# EAGLE schematic LightPCB (EAGLE 7.3.0)
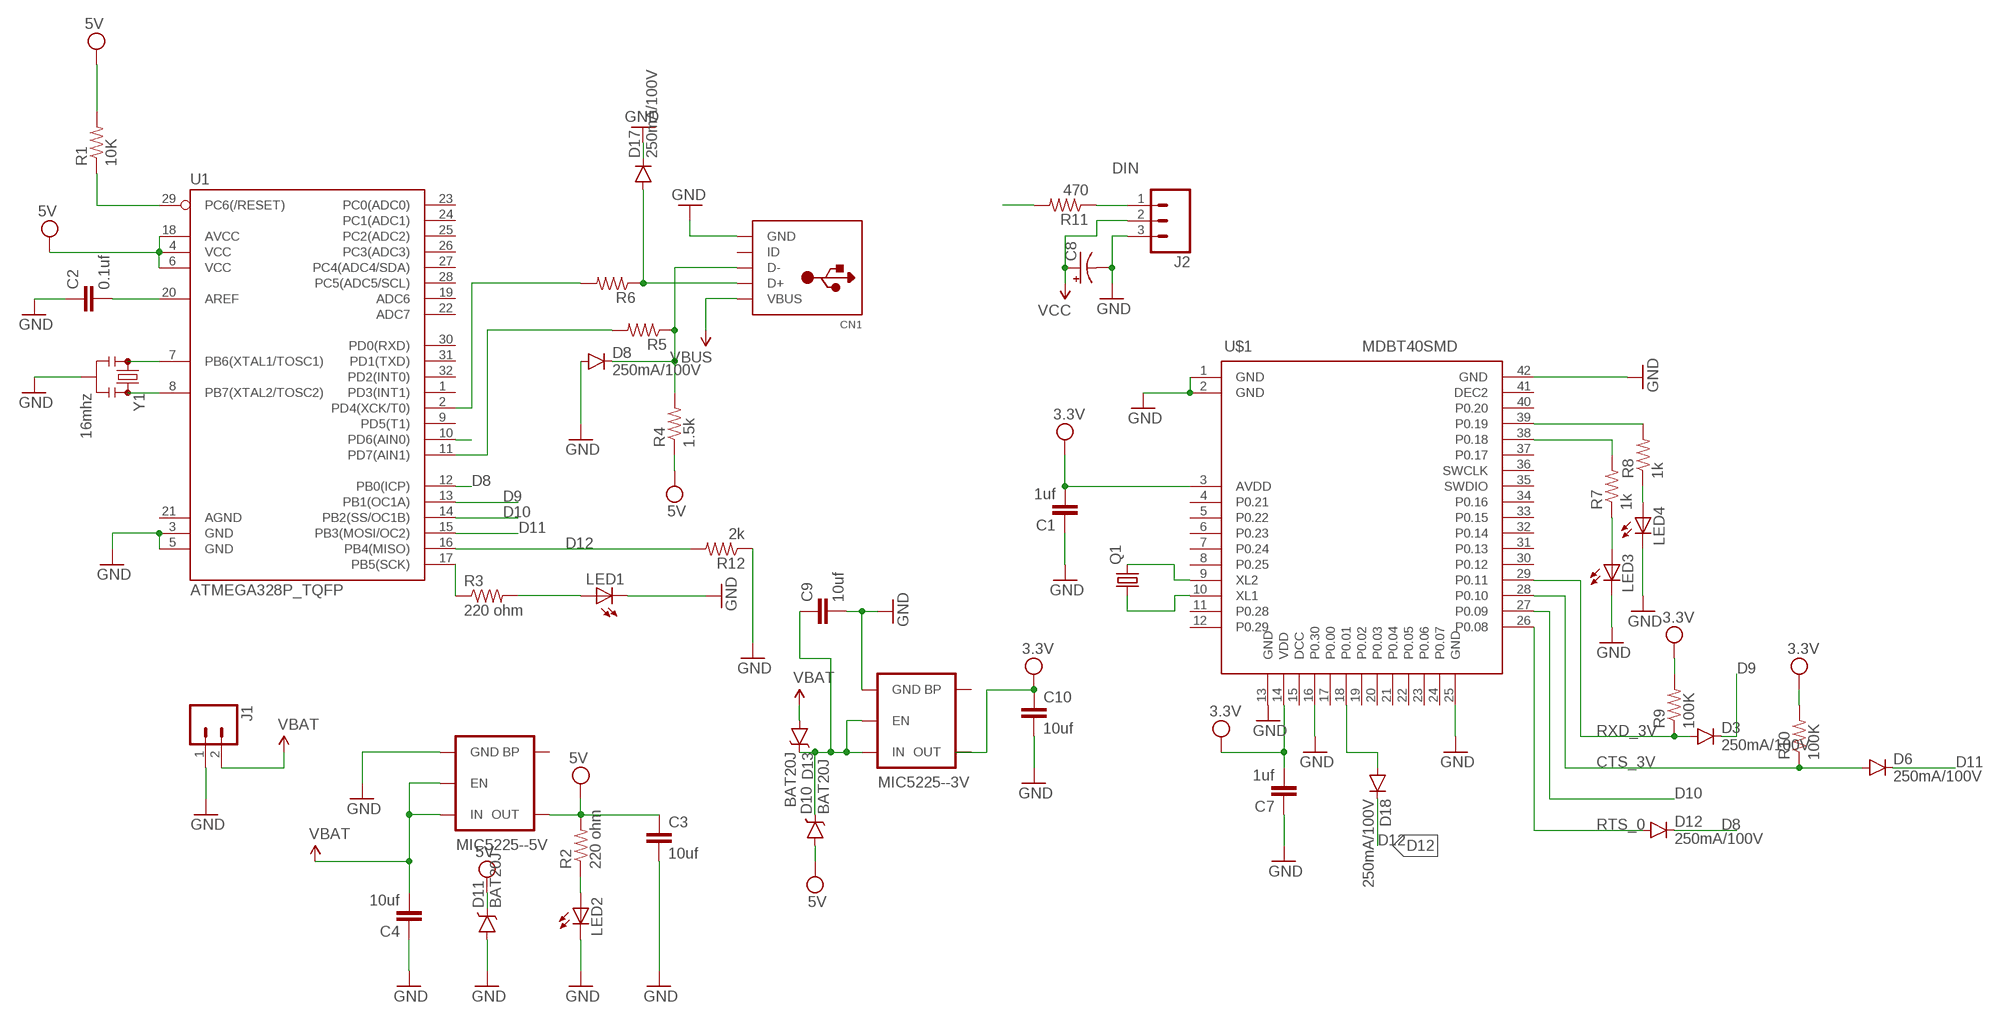
[diagram p0: schematic, sheet 1]

## Parts
C1  1uf  CAP0603-CAP  [0603-CAP]
C2  0.1uf  CAP0603-CAP  [0603-CAP]
C3  10uf  CAP0603-CAP  [0603-CAP]
C4  10uf  CAP0603-CAP  [0603-CAP]
C7  1uf  CAP0603-CAP  [0603-CAP]
C8  CAP_POLPTH4  [CPOL-RADIAL-1000UF-25V]
C9  10uf  CAP0603-CAP  [0603-CAP]
C10  10uf  CAP0603-CAP  [0603-CAP]
CN1  USBMINIB  [USB-MINIB]
D3  250mA/100V  DIODEBAS16  [SOD-323]
D6  250mA/100V  DIODEBAS16  [SOD-323]
D8  250mA/100V  DIODEBAS16  [SOD-323]
D10  BAT20J  DIODE-SCHOTTKY-BAT20J  [SOD-323]
D11  BAT20J  DIODE-SCHOTTKY-BAT20J  [SOD-323]
D12  250mA/100V  DIODEBAS16  [SOD-323]
D13  BAT20J  DIODE-SCHOTTKY-BAT20J  [SOD-323]
D17  250mA/100V  DIODEBAS16  [SOD-323]
D18  250mA/100V  DIODEBAS16  [SOD-323]
J1  M02LOCK_LONGPADS  [1X02_LOCK_LONGPADS]
J2  M03PTH  [1X03]
LED1  LEDCHIPLED_0603  [CHIPLED_0603]
LED2  LEDCHIPLED_0603  [CHIPLED_0603]
LED3  LEDCHIPLED_0603  [CHIPLED_0603]
LED4  LEDCHIPLED_0603  [CHIPLED_0603]
MIC5225--3V  MIC52055V  [SOT23-5]
MIC5225--5V  MIC52055V  [SOT23-5]
Q1  CRYSTALMM20SS  [MM20SS]
R1  10K  RESISTOR0603  [0603-RES]
R2  220 ohm  RESISTOR0603  [0603-RES]
R3  220 ohm  RESISTOR0603  [0603-RES]
R4  1.5k  RESISTOR0603  [0603-RES]
R5  RESISTOR0603-RES  [0603-RES]
R6  RESISTOR0603-RES  [0603-RES]
R7  1k  RESISTOR0603-RES  [0603-RES]
R8  1k  RESISTOR0603-RES  [0603-RES]
R9  100K  RESISTOR0603-RES  [0603-RES]
R10  100K  RESISTOR0603-RES  [0603-RES]
R11  470  RESISTOR0603  [0603-RES]
R12  2k  RESISTOR0603  [0603-RES]
U1  ATMEGA328P_TQFP  [TQFP32-08]
U$1  MDBT40SMD  [MDBT40]
Y1  16mhz  RESONATOR4MHZ  [RESONATOR-SMD_MED]

## Nets
3V: C1.2 C7.2 R10.2 U$1.3(AVDD) U$1.14(VDD) ; supply symbol labelled 3.3V
5V: U1.4(VCC) U1.6(VCC) U1.18(AVCC)
CTS_3V: D6.A R10.1 U$1.28(P0.10)
D6: R11.2 U1.10(PD6(AIN0))
D8: D12.C U1.12(PB0(ICP))
D9: D3.C U1.13(PB1(OC1A))
D10: U1.14(PB2(SS/OC1B)) U$1.27(P0.09)
D11: D6.C U1.15(PB3(MOSI/OC2))
D12: D18.C R12.2 U1.16(PB4(MISO))
DIN: J2.1 R11.1
GND: C1.1 C2.1 C3.2 C4.1 C7.1 C8.- C9.2 C10.2 CN1.GND D8.A D11.A D17.C J1.1 J2.3 LED1.C LED2.C LED3.C LED4.C MIC5225--3V.2(GND) MIC5225--5V.2(GND) R12.1 U1.3(GND) U1.5(GND) U$1.1(GND) U$1.2(GND) U$1.13(GND) U$1.16(P0.30) U$1.25(GND) U$1.42(GND) Y1.2
N$1: C2.2 U1.20(AREF)
N$2: U1.8(PB7(XTAL2/TOSC2)) Y1.3
N$3: R1.1 U1.29(PC6(/RESET))
N$4: U1.7(PB6(XTAL1/TOSC1)) Y1.1
N$5: R5.2 U1.11(PD7(AIN1))
N$6: CN1.D- D8.C R4.2 R5.1
N$7: CN1.D+ D17.A R6.1
N$8: R6.2 U1.2(PD4(XCK/T0))
N$9: R3.1 U1.17(PB5(SCK))
N$10: LED1.A R3.2
N$11: LED2.A R2.1
N$12: Q1.4 U$1.9(XL2)
N$13: Q1.1 U$1.10(XL1)
N$14: LED3.A R7.1
N$15: LED4.A R8.1
N$16: R8.2 U$1.39(P0.19)
N$17: R7.2 U$1.38(P0.18)
N$19: D18.A U$1.18(P0.01)
N$21: C9.1 D10.C D13.C MIC5225--3V.1(IN) MIC5225--3V.3(EN)
RTS_0: D12.A U$1.26(P0.08)
RXD_3V: D3.A R9.1 U$1.29(P0.11)
VCC: C3.1 C8.+ C10.1 CN1.VBUS D10.A D11.C J2.2 MIC5225--5V.5(OUT) R1.2 R2.2 R4.1 R9.2 ; supply symbol labelled VBUS, 5V, 3.3V
VIN: C4.2 D13.A J1.2 MIC5225--5V.1(IN) MIC5225--5V.3(EN) ; supply symbol labelled VBAT
Unconnected: CN1.ID MIC5225--3V.4(BP) MIC5225--3V.5(OUT) MIC5225--5V.4(BP) U1.1(PD3(INT1)) U1.9(PD5(T1)) U1.19(ADC6) U1.21(AGND) U1.22(ADC7) U1.23(PC0(ADC0)) U1.24(PC1(ADC1)) U1.25(PC2(ADC2)) U1.26(PC3(ADC3)) U1.27(PC4(ADC4/SDA)) U1.28(PC5(ADC5/SCL)) U1.30(PD0(RXD)) U1.31(PD1(TXD)) U1.32(PD2(INT0)) U$1.4(P0.21) U$1.5(P0.22) U$1.6(P0.23) U$1.7(P0.24) U$1.8(P0.25) U$1.11(P0.28) U$1.12(P0.29) U$1.15(DCC) U$1.17(P0.00) U$1.19(P0.02) U$1.20(P0.03) U$1.21(P0.04) U$1.22(P0.05) U$1.23(P0.06) U$1.24(P0.07) U$1.30(P0.12) U$1.31(P0.13) U$1.32(P0.14) U$1.33(P0.15) U$1.34(P0.16) U$1.35(SWDIO) U$1.36(SWCLK) U$1.37(P0.17) U$1.40(P0.20) U$1.41(DEC2)

## Library data of the parts
C1-C4 C7 C9 C10 = SparkFun-Capacitors:CAP: Capacitor Standard 0603 ceramic capacitor, and 0.1" leaded capacitor.
C8 = SparkFun-Capacitors:CAP_POL: Capacitor Polarized These are standard SMD and PTH capacitors. Normally 10uF, 47uF, and 100uF in electrolytic and tantalum varieties. Always verify the external diameter of the through hole cap, it varies with capacity, voltage, and manufacturer. The EIA devices should be standard.
CN1 = adafruit:USB: USB Connectors USBMINIB - Surface Mount Female Mini-B USB Connector 4UConnector: 06564 By microbuilder.eu Thru-hole RA Female Mini-B USB Connector 4UConnector: 18732 By ladyada.net
D3 D6 D8 D12 D17 D18 = SparkFun-DiscreteSemi:DIODE: Diode These are standard reverse protection diodes and small signal diodes. SMA package can handle up to about 1A. SOD-323 can handle about 200mA. What the SOD-323 package when ordering, there are some mfgs out there that are 5-pin packages.; PROD_ID: DIO-09646
D10 D11 D13 = SparkFun-DiscreteSemi:DIODE-SCHOTTKY: Schottky diodes in SFE's production catalog BAT20J 1A 23V 0.62Vf RB751 120mA 40V 0.37Vf PMEG4005EJ 0.5A 40V 0.42Vf MBRA140 1A 40V 0.5Vf B340A 3A 40V SMA; PROD_ID: DIO-11623
J1 = SparkFun-Connectors:M02: Standard 2-pin 0.1" header. Use with - straight break away headers ( PRT-00116) - right angle break away headers (PRT-00553) - swiss pins (PRT-00743) - machine pins (PRT-00117) - female headers (PRT-00115) Molex polarized connector foot print use with: PRT-08233 with associated crimp pins and housings. 2.54_SCREWTERM for use with PRT-10571. 3.5mm Screw Terminal footprints for PRT-08084 5mm Screw Terminal footprints for use with PRT-08432
J2 = SparkFun-Connectors:M03: Header 3 Standard 3-pin 0.1" header. Use with straight break away headers (SKU : PRT-00116), right angle break away headers (PRT-00553), swiss pins (PRT-00743), machine pins (PRT-00117), and female headers (PRT-00115). Molex polarized connector foot print use with SKU : PRT-08232 with associated crimp pins and housings.
LED1 LED2 = adafruit:LED: LED
LED3 LED4 = led:LED: LED
MIC5225--3V MIC5225--5V = SparkFun-PowerIC:MIC5205: MIC5205 150mA vreg 3.3V - VREG-00822 5V - VREG-00823; PROD_ID: VREG-00823
Q1 = adafruit:CRYSTAL: CRYSTAL; OC_FARNELL: unknown; OC_NEWARK: unknown
R1-R4 R11 R12 = SparkFun-Resistors:RESISTOR: Resistor Basic schematic elements and footprints for 0603, 1206, and PTH resistors.
R5-R10 = SparkFun-Passives:RESISTOR: Resistor Basic schematic elements and footprints for 0603, 1206, and PTH resistors.
U1 = SparkFun-DigitalIC:ATMEGA328P_TQFP; PROD_ID: IC-09069
U$1 = MDBT40BLUZ:MDBT40
Y1 = SparkFun-FreqCtrl:RESONATOR: Resonator Small SMD resonator. Used, eg, on the Arduino Pro/ Pro Mini boards. 8MHz- XTAL-08895 16MHz- XTAL-08900; PROD_ID: XTAL-12492; VALUE: 4MHz